# EAGLE schematic 4 digit seven segment  (EAGLE 6.1)
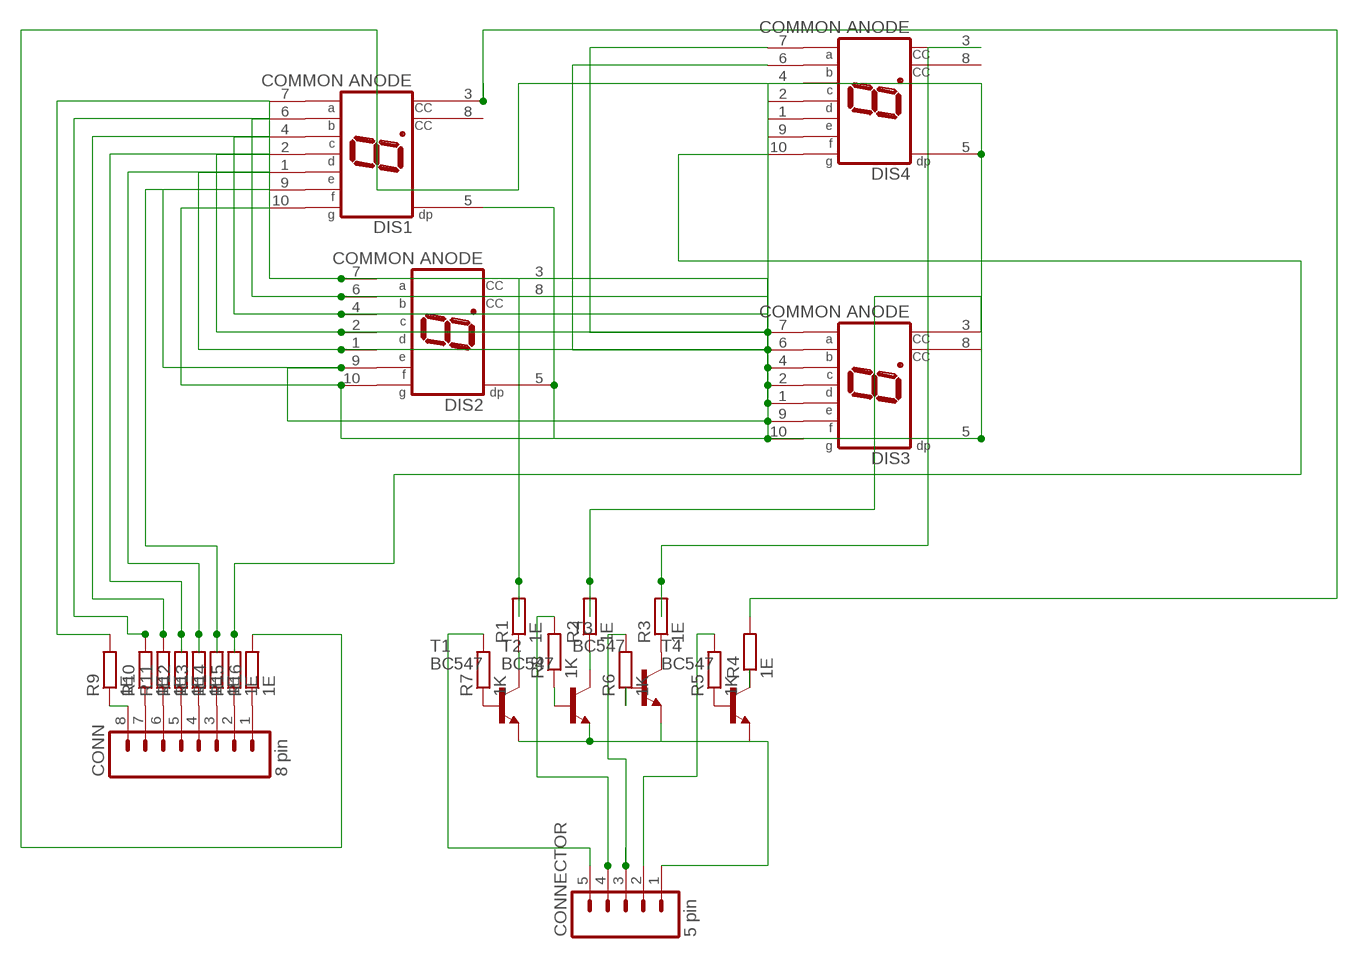
[diagram p0: schematic, sheet 1]

## Parts
CONN  8 pin  M08  [08P]
CONNECTOR  5 pin  M05  [05P]
DIS1  COMMON ANODE  HD-H103  [HDSP-M]
DIS2  COMMON ANODE  HD-H103  [HDSP-M]
DIS3  COMMON ANODE  HD-H103  [HDSP-M]
DIS4  COMMON ANODE  HD-H103  [HDSP-M]
R1  1E  R-EU_0204/7  [0204/7]
R2  1E  R-EU_0204/7  [0204/7]
R3  1E  R-EU_0204/7  [0204/7]
R4  1E  R-EU_0204/7  [0204/7]
R5  1K  R-EU_0204/7  [0204/7]
R6  1K  R-EU_0204/7  [0204/7]
R7  1K  R-EU_0204/7  [0204/7]
R8  1K  R-EU_0204/7  [0204/7]
R9  1E  R-EU_0204/7  [0204/7]
R10  1E  R-EU_0204/7  [0204/7]
R11  1E  R-EU_0204/7  [0204/7]
R12  1E  R-EU_0204/7  [0204/7]
R13  1E  R-EU_0204/7  [0204/7]
R14  1E  R-EU_0204/7  [0204/7]
R15  1E  R-EU_0204/7  [0204/7]
R16  1E  R-EU_0204/7  [0204/7]
T1  BC547  [TO92]
T2  BC547  [TO92]
T3  BC547  [TO92]
T4  BC547  [TO92]

## Nets
N$1: CONNECTOR.4 R8.2
N$2: DIS1.9(F) DIS2.9(F) DIS3.9(F) DIS4.9(F) R14.2
N$3: DIS1.2(D) DIS2.2(D) DIS3.2(D) DIS4.2(D) R12.2
N$4: DIS1.6(B) DIS2.6(B) DIS3.6(B) DIS4.6(B) R10.2
N$5: DIS1.7(A) DIS2.7(A) DIS3.7(A) DIS4.7(A) R9.2
N$6: DIS3.3(CC) R2.2
N$7: DIS1.4(C) DIS2.4(C) DIS3.4(C) DIS4.4(C) R11.2
N$8: DIS1.1(E) DIS2.1(E) DIS3.1(E) DIS4.1(E) R13.2
N$9: CONNECTOR.3 R6.2
N$10: DIS3.8(CC)
N$11: R1.1 T1.3(C)
N$12: R2.1 T2.3(C)
N$13: R3.1 T3.3(C)
N$14: R4.1 T4.3(C)
N$15: R5.1 T4.2(B)
N$16: R6.1 T3.2(B)
N$17: R7.1 T1.2(B)
N$18: R8.1 T2.2(B)
N$19: CONN.8 R9.1
N$20: CONN.7 R10.1
N$21: CONN.6 R11.1
N$22: CONN.4 R13.1
N$23: CONN.3 R14.1
N$24: CONN.2 R15.1
N$25: CONN.1 R16.1
N$26: CONN.5 R12.1
N$27: DIS1.10(G) DIS2.10(G) DIS3.10(G) DIS4.10(G) R15.2
N$28: DIS1.5(DP) DIS2.5(DP) DIS3.5(DP) DIS4.5(DP) R16.2
N$29: CONNECTOR.5 R7.2
N$30: CONNECTOR.2 R5.2
N$31: CONNECTOR.1 T1.1(E) T2.1(E) T3.1(E) T4.1(E)
N$32: DIS1.3(CC) R4.2
N$33: DIS4.3(CC) R3.2
N$34: DIS2.3(CC) R1.2
Unconnected: DIS1.8(CC) DIS2.8(CC) DIS4.8(CC)

## Library data of the parts
CONN = con-amp-quick:M08: AMP QUICK CONNECTOR; OC_FARNELL: unknown; OC_NEWARK: unknown
CONNECTOR = con-amp-quick:M05: AMP QUICK CONNECTOR; OC_FARNELL: unknown; OC_NEWARK: unknown
DIS1-DIS4 = display-hp:HD-H103: LED DISPLAY 1-character 7 segment, decimal point right; OC_FARNELL: unknown; OC_NEWARK: unknown
R1-R16 = rcl:R-EU_: RESISTOR, European symbol
T1-T4 = transistor:BC547: NPN TRANSISTOR